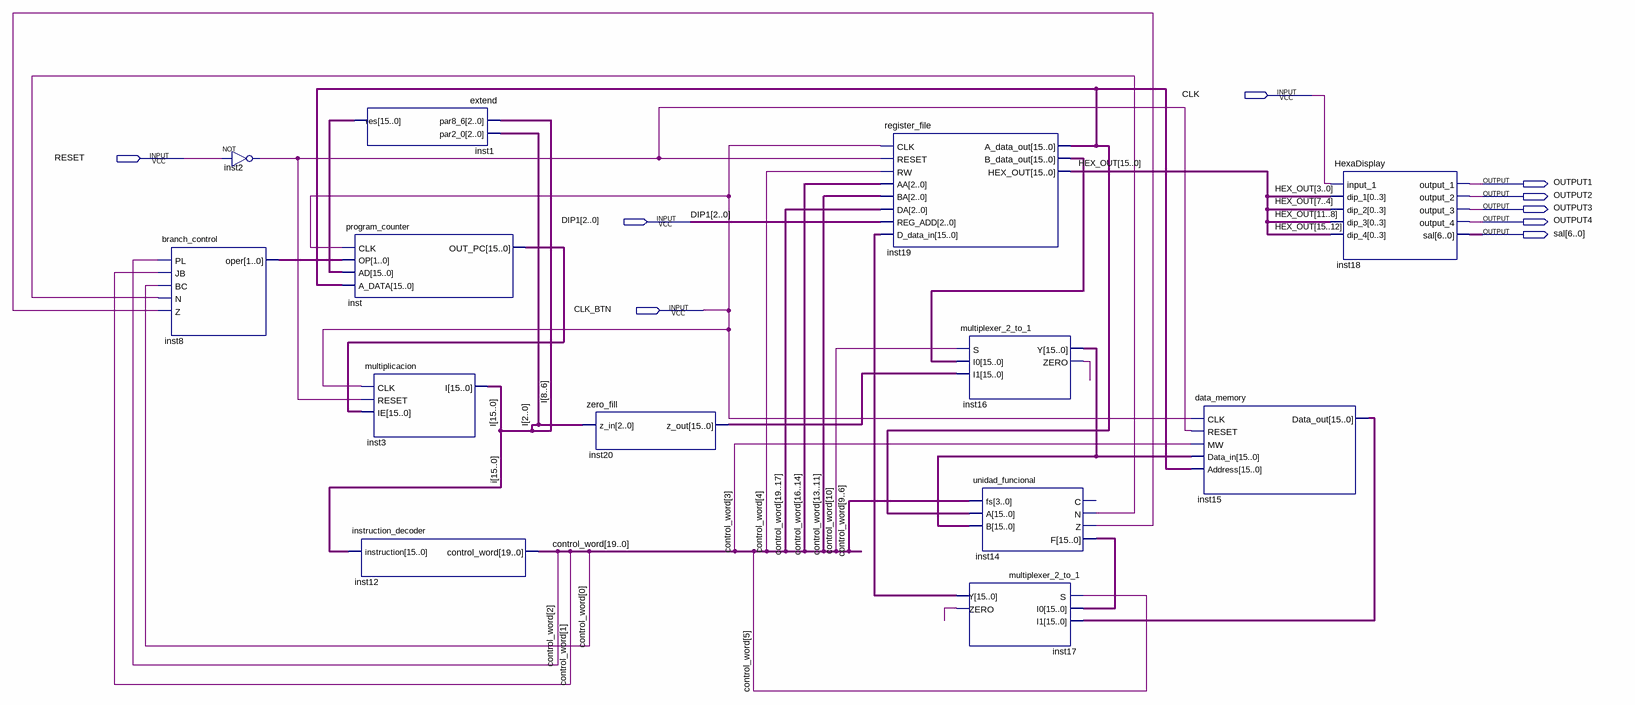
[diagram p0: schematic sheet]
// Quartus schematic Final.bdf as structural Verilog: 13 symbols, 9 pins
module Final (
  input  CLK,
  input  RESET,
  input  [2:0] DIP1,
  input  CLK_BTN,
  output OUTPUT1,
  output OUTPUT2,
  output OUTPUT3,
  output OUTPUT4,
  output [6:0] sal
);

  wire inst2_out, inst14_n, inst14_z, inst16_zero, inst17_zero;
  wire [1:0] inst8_oper;
  wire [15:0] HEX_OUT, I, inst1_res, inst14_f, inst15_data_out, inst16_y, inst17_y, inst19_a_data_out,
       inst19_b_data_out, inst20_z_out, inst_out_pc;
  wire [19:0] control_word;

  branch_control inst8 (
    .PL(control_word[2]), .JB(control_word[1]), .BC(control_word[0]), .N(inst14_n), .Z(inst14_z),
    .oper(inst8_oper));
  not inst2 (inst2_out, RESET);
  program_counter inst (
    .CLK(CLK_BTN), .OP(inst8_oper), .AD(inst1_res), .A_DATA(inst19_a_data_out), .OUT_PC(inst_out_pc));
  extend inst1 (.par8_6(I[8:6]), .par2_0(I[2:0]), .res(inst1_res));
  multiplicacion inst3 (.CLK(CLK_BTN), .RESET(inst2_out), .IE(inst_out_pc), .I(I));
  instruction_decoder inst12 (.instruction(I), .control_word(control_word));
  zero_fill inst20 (.z_in(I[2:0]), .z_out(inst20_z_out));
  register_file inst19 (
    .CLK(CLK_BTN), .RESET(inst2_out), .RW(control_word[4]), .AA(control_word[16:14]),
    .BA(control_word[13:11]), .DA(control_word[19:17]), .REG_ADD(DIP1), .D_data_in(inst17_y),
    .A_data_out(inst19_a_data_out), .B_data_out(inst19_b_data_out), .HEX_OUT(HEX_OUT));
  multiplexer_2_to_1 inst16 (
    .S(control_word[10]), .I0(inst19_b_data_out), .I1(inst20_z_out), .Y(inst16_y), .ZERO(inst16_zero));
  unidad_funcional inst14 (
    .fs(control_word[9:6]), .A(inst19_a_data_out), .B(inst16_y), .N(inst14_n), .Z(inst14_z), .F(inst14_f));  // open: C
  multiplexer_2_to_1 inst17 (
    .S(control_word[5]), .I0(inst14_f), .I1(inst15_data_out), .Y(inst17_y), .ZERO(inst17_zero));
  data_memory inst15 (
    .CLK(CLK_BTN), .RESET(inst2_out), .MW(control_word[3]), .Data_in(inst16_y), .Address(inst19_a_data_out),
    .Data_out(inst15_data_out));
  HexaDisplay inst18 (
    .input_1(CLK), .dip_1(HEX_OUT[3:0]), .dip_2(HEX_OUT[7:4]), .dip_3(HEX_OUT[11:8]), .dip_4(HEX_OUT[15:12]),
    .output_1(OUTPUT1), .output_2(OUTPUT2), .output_3(OUTPUT3), .output_4(OUTPUT4), .sal(sal));
endmodule
